# EAGLE schematic DualPanningMixer (EAGLE 9.5.2)
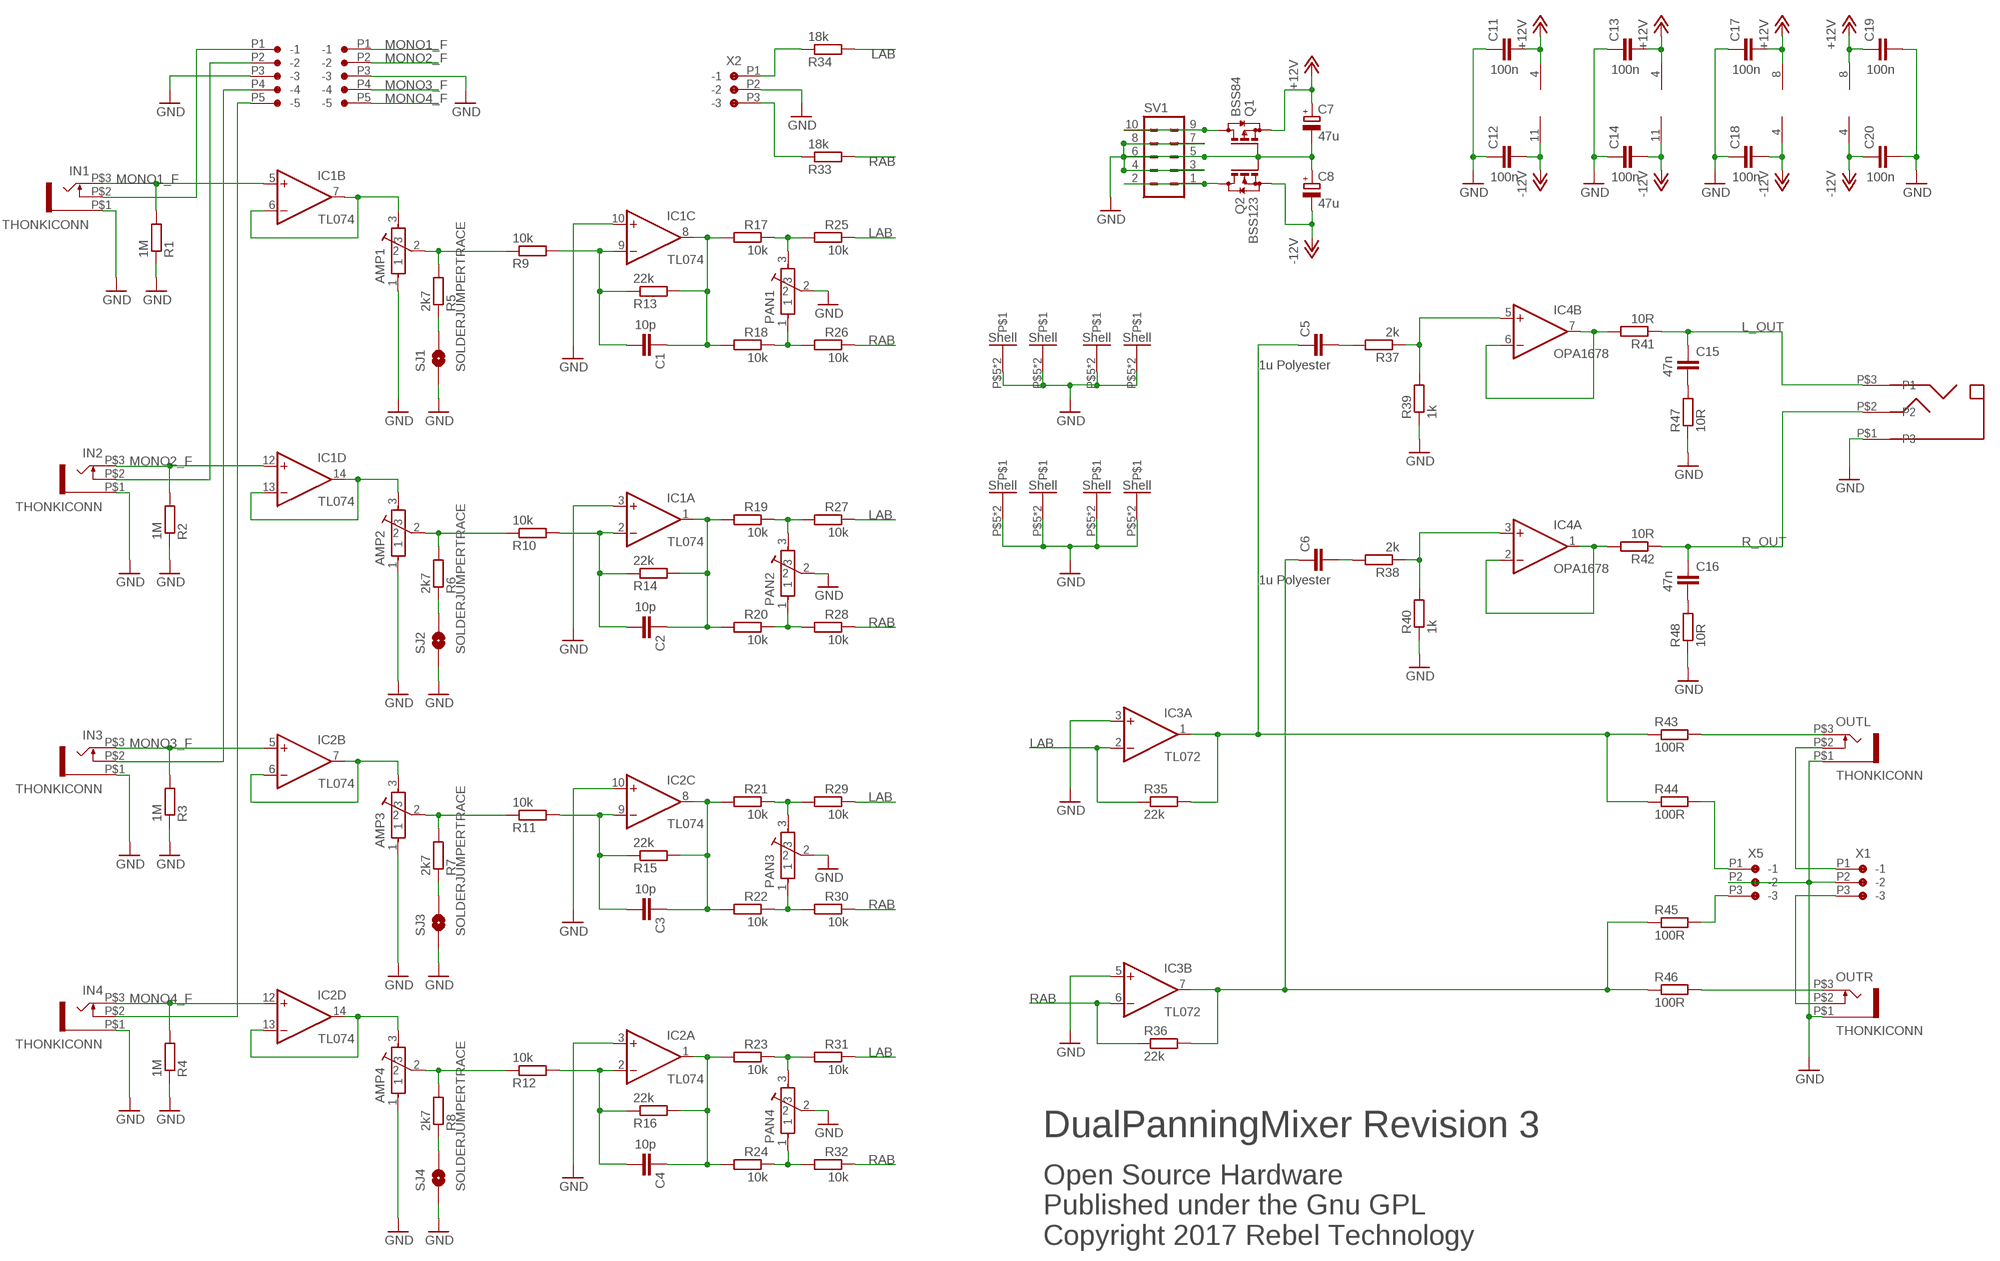
[diagram p0: schematic, sheet 1]

## Parts
AMP1  POT-ALPS-RK09L1140  [POT-ALPS-RK09L1140]
AMP2  POT-ALPS-RK09L1140  [POT-ALPS-RK09L1140]
AMP3  POT-ALPS-RK09L1140  [POT-ALPS-RK09L1140]
AMP4  POT-ALPS-RK09L1140  [POT-ALPS-RK09L1140]
C1  10p  C-EUC0603  [C0603]
C2  10p  C-EUC0603  [C0603]
C3  10p  C-EUC0603  [C0603]
C4  10p  C-EUC0603  [C0603]
C5  1u Polyester  C-EUC1210  [C1210]
C6  1u Polyester  C-EUC1210  [C1210]
C7  47u  CPOL-EUUD-5X5,8  [UD-5X5,8_NICHICON]
C8  47u  CPOL-EUUD-5X5,8  [UD-5X5,8_NICHICON]
C11  100n  C-EUC0603  [C0603]
C12  100n  C-EUC0603  [C0603]
C13  100n  C-EUC0603  [C0603]
C14  100n  C-EUC0603  [C0603]
C15  47n  C-EUC0603  [C0603]
C16  47n  C-EUC0603  [C0603]
C17  100n  C-EUC0603  [C0603]
C18  100n  C-EUC0603  [C0603]
C19  100n  C-EUC0603  [C0603]
C20  100n  C-EUC0603  [C0603]
IC1  TL074  TL074D  [SO14]
IC2  TL074  TL074D  [SO14]
IC3  TL072  NE5532D  [SO08]
IC4  OPA1678  NE5532D  [SO08]
IN1  THONKICONN  [THONKICONN]
IN2  THONKICONN  [THONKICONN]
IN3  THONKICONN  [THONKICONN]
IN4  THONKICONN  [THONKICONN]
OUTHP  THONKICONN_STEREO  [THONKICONN_STEREO]
OUTL  THONKICONN  [THONKICONN]
OUTR  THONKICONN  [THONKICONN]
PAN1  POT-ALPS-RK09L1140  [POT-ALPS-RK09L1140]
PAN2  POT-ALPS-RK09L1140  [POT-ALPS-RK09L1140]
PAN3  POT-ALPS-RK09L1140  [POT-ALPS-RK09L1140]
PAN4  POT-ALPS-RK09L1140  [POT-ALPS-RK09L1140]
Q1  BSS84  [SOT23]
Q2  BSS123  [SOT23]
R1  1M  R-EU_0603  [0603]
R2  1M  R-EU_0603  [0603]
R3  1M  R-EU_0603  [0603]
R4  1M  R-EU_0603  [0603]
R5  2k7  R-EU_0603  [0603]
R6  2k7  R-EU_0603  [0603]
R7  2k7  R-EU_0603  [0603]
R8  2k7  R-EU_0603  [0603]
R9  10k  R-EU_0603  [0603]
R10  10k  R-EU_0603  [0603]
R11  10k  R-EU_0603  [0603]
R12  10k  R-EU_0603  [0603]
R13  22k  R-EU_0603  [0603]
R14  22k  R-EU_0603  [0603]
R15  22k  R-EU_0603  [0603]
R16  22k  R-EU_0603  [0603]
R17  10k  R-EU_0603  [0603]
R18  10k  R-EU_0603  [0603]
R19  10k  R-EU_0603  [0603]
R20  10k  R-EU_0603  [0603]
R21  10k  R-EU_0603  [0603]
R22  10k  R-EU_0603  [0603]
R23  10k  R-EU_0603  [0603]
R24  10k  R-EU_0603  [0603]
R25  10k  R-EU_0603  [0603]
R26  10k  R-EU_0603  [0603]
R27  10k  R-EU_0603  [0603]
R28  10k  R-EU_0603  [0603]
R29  10k  R-EU_0603  [0603]
R30  10k  R-EU_0603  [0603]
R31  10k  R-EU_0603  [0603]
R32  10k  R-EU_0603  [0603]
R33  18k  R-EU_0603  [0603]
R34  18k  R-EU_0603  [0603]
R35  22k  R-EU_0603  [0603]
R36  22k  R-EU_0603  [0603]
R37  2k  R-EU_0603  [0603]
R38  2k  R-EU_0603  [0603]
R39  1k  R-EU_0603  [0603]
R40  1k  R-EU_0603  [0603]
R41  10R  R-EU_0603  [0603]
R42  10R  R-EU_0603  [0603]
R43  100R  R-EU_0603  [0603]
R44  100R  R-EU_0603  [0603]
R45  100R  R-EU_0603  [0603]
R46  100R  R-EU_0603  [0603]
R47  10R  R-EU_0603  [0603]
R48  10R  R-EU_0603  [0603]
SJ1  SOLDERJUMPERTRACE  [SJ_2S-TRACE]
SJ2  SOLDERJUMPERTRACE  [SJ_2S-TRACE]
SJ3  SOLDERJUMPERTRACE  [SJ_2S-TRACE]
SJ4  SOLDERJUMPERTRACE  [SJ_2S-TRACE]
SV1  MA05-2  [MA05-2]
X1  CON-JST_PH_3W  [CON-JST_PH_3W]
X2  CON-JST_PH_3W  [CON-JST_PH_3W]
X3  CON-JST_PH_5W  [CON-JST_PH_5W]
X4  CON-JST_PH_5W  [CON-JST_PH_5W]
X5  CON-JST_PH_3W  [CON-JST_PH_3W]

## Nets
+12V: C7.+ C11.2 C13.2 C17.2 C19.1 IC1.4(P:V+) IC2.4(P:V+) IC3.8(P:V+) IC4.8(P:V+) Q1.2(S)
-12V: C8.- C12.2 C14.2 C18.2 C20.1 IC1.11(P:V-) IC2.11(P:V-) IC3.4(P:V-) IC4.4(P:V-) Q2.2(S)
GND: AMP1.1 AMP1.P$5 AMP1.P$6 AMP2.1 AMP2.P$5 AMP2.P$6 AMP3.1 AMP3.P$5 AMP3.P$6 AMP4.1 AMP4.P$5 AMP4.P$6 C7.- C8.+ C11.1 C12.1 C13.1 C14.1 C17.1 C18.1 C19.2 C20.2 IC1.3(A:+IN) IC1.10(C:+IN) IC2.3(A:+IN) IC2.10(C:+IN) IC3.3(A:+IN) IC3.5(B:+IN) IN1.P$1 IN2.P$1 IN3.P$1 IN4.P$1 OUTHP.P$1(P3) OUTL.P$1 OUTR.P$1 PAN1.2 PAN1.P$5 PAN1.P$6 PAN2.2 PAN2.P$5 PAN2.P$6 PAN3.2 PAN3.P$5 PAN3.P$6 PAN4.2 PAN4.P$5 PAN4.P$6 Q1.1(G) Q2.1(G) R1.1 R2.1 R3.1 R4.1 R39.1 R40.1 R47.1 R48.1 SJ1.1 SJ2.1 SJ3.1 SJ4.1 SV1.3 SV1.4 SV1.5 SV1.6 SV1.7 SV1.8 X1.P2(-2) X2.P2(-2) X3.P3(-3) X4.P3(-3) X5.P2(-2)
L_OUT: C15.1 OUTHP.P$3(P1) R41.1
LAB: IC3.2(A:-IN) R25.1 R27.1 R29.1 R31.1 R34.2 R35.1
MONO1: AMP1.3 IC1.6(B:-IN) IC1.7(B:OUT)
MONO1_F: IC1.5(B:+IN) IN1.P$3 R1.2 X3.P1(-1)
MONO2: AMP2.3 IC1.13(D:-IN) IC1.14(D:OUT)
MONO2_F: IC1.12(D:+IN) IN2.P$3 R2.2 X3.P2(-2)
MONO3: AMP3.3 IC2.6(B:-IN) IC2.7(B:OUT)
MONO3_F: IC2.5(B:+IN) IN3.P$3 R3.2 X3.P4(-4)
MONO4: AMP4.3 IC2.13(D:-IN) IC2.14(D:OUT)
MONO4_F: IC2.12(D:+IN) IN4.P$3 R4.2 X3.P5(-5)
N$1: AMP4.2 R8.2 R12.1
N$2: IN2.P$2 X4.P2(-2)
N$3: C5.1 IC3.1(A:OUT) R35.2 R43.1 R44.1
N$4: IN1.P$2 X4.P1(-1)
N$5: C6.1 IC3.7(B:OUT) R36.2 R45.1 R46.1
N$6: IN3.P$2 X4.P4(-4)
N$7: IC4.3(A:+IN) R38.1 R40.2
N$8: AMP1.2 R5.2 R9.1
N$9: C1.2 IC1.9(C:-IN) R9.2 R13.1
N$10: AMP3.2 R7.2 R11.1
N$11: AMP2.2 R6.2 R10.1
N$12: R5.1 SJ1.2
N$13: IC4.5(B:+IN) R37.1 R39.2
N$14: R33.1 X2.P3(-3)
N$15: IN4.P$2 X4.P5(-5)
N$16: R6.1 SJ2.2
N$17: PAN1.1 R18.1 R26.2
N$19: PAN1.3 R17.1 R25.2
N$20: R7.1 SJ3.2
N$21: R8.1 SJ4.2
N$23: C1.1 IC1.8(C:OUT) R13.2 R17.2 R18.2
N$24: R34.1 X2.P1(-1)
N$25: C4.1 IC2.1(A:OUT) R16.2 R23.2 R24.2
N$26: C2.1 IC1.1(A:OUT) R14.2 R19.2 R20.2
N$33: PAN2.3 R19.1 R27.2
N$34: OUTL.P$3 R43.2
N$35: PAN2.1 R20.1 R28.2
N$36: PAN3.3 R21.1 R29.2
N$37: C3.1 IC2.8(C:OUT) R15.2 R21.2 R22.2
N$38: PAN3.1 R22.1 R30.2
N$39: PAN4.3 R23.1 R31.2
N$40: OUTR.P$3 R46.2
N$41: PAN4.1 R24.1 R32.2
N$42: C16.2 R48.2
N$43: C2.2 IC1.2(A:-IN) R10.2 R14.1
N$44: Q2.3(D) SV1.1 SV1.2
N$45: C3.2 IC2.9(C:-IN) R11.2 R15.1
N$46: Q1.3(D) SV1.9 SV1.10
N$47: C4.2 IC2.2(A:-IN) R12.2 R16.1
N$48: C15.2 R47.2
N$49: C5.2 R37.2
N$52: IC4.6(B:-IN) IC4.7(B:OUT) R41.2
N$53: IC4.1(A:OUT) IC4.2(A:-IN) R42.2
N$54: C6.2 R38.2
OUT_NS_L: R44.2 X5.P1(-1)
OUT_NS_R: R45.2 X5.P3(-3)
OUT_SW_L: OUTL.P$2 X1.P1(-1)
OUT_SW_R: OUTR.P$2 X1.P3(-3)
R_OUT: C16.1 OUTHP.P$2(P2) R42.1
RAB: IC3.6(B:-IN) R26.1 R28.1 R30.1 R32.1 R33.2 R36.1

## Notes on the sheet
- DualPanningMixer Revision 3
- Open Source Hardware
  Published under the Gnu GPL
  Copyright 2017 Rebel Technology

## Library data of the parts
AMP1-AMP4 PAN1-PAN4 = Rebel:POT-ALPS-RK09L
C1-C6 C11-C20 = Rebel:C-EU: CAPACITOR, European symbol
C7 C8 = Rebel:CPOL-EU: POLARIZED CAPACITOR, European symbol
IC1 IC2 = Rebel:TL074: OP AMP
IC3 IC4 = Rebel:NE5532: AUDIO AMPLIFIER
IN1-IN4 OUTL OUTR = Rebel:THONKICONN
OUTHP = Rebel:THONKICONN_STEREO
Q1 = transistor-small-signal:BSS84: P-CHANNEL MOS FET
Q2 = transistor-small-signal:BSS123: N-CHANNEL MOS FET
R1-R48 = Rebel:R-EU_: RESISTOR, European symbol
SJ1-SJ4 = SparkFun:SOLDERJUMPER: Solder Jumper Standard SMD solder jumper. Used to automate production. Two varients : Normally Open and Normally Closed are the same, but have different paste layers. NC will have a large amount of paste and should jumper during reflow.
SV1 = Rebel:MA05-2: PIN HEADER; OC_FARNELL: unknown; OC_NEWARK: unknown
X1 X2 X5 = Rebel:CON-JST_PH_3W
X3 X4 = Rebel:CON-JST_PH_5W